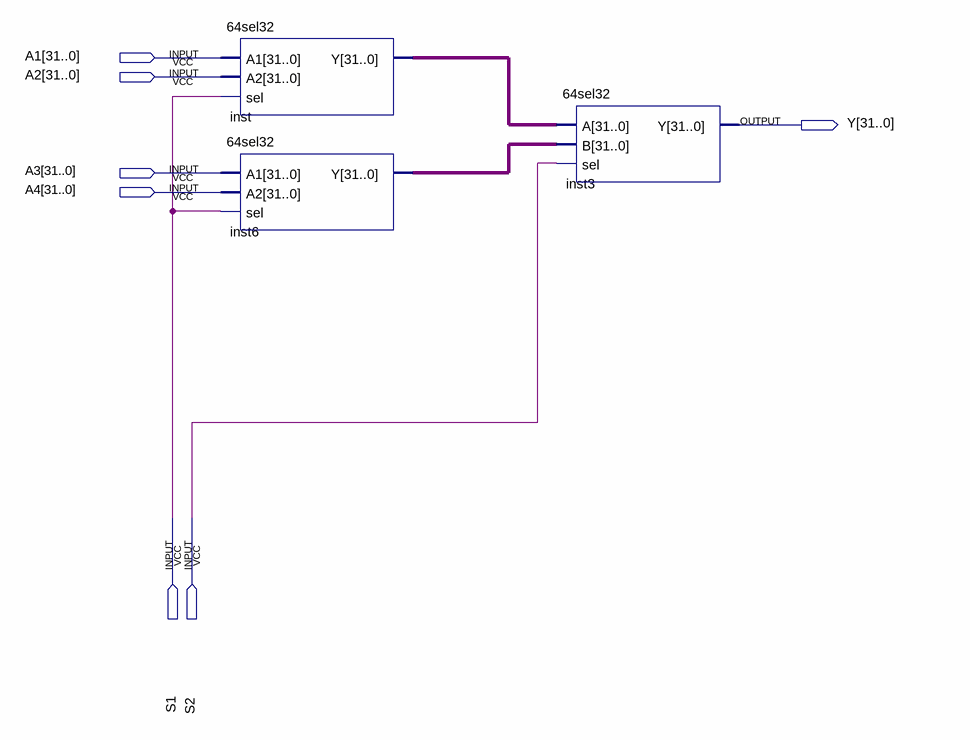
[diagram p0: schematic sheet]
// Quartus schematic 128sel32.bdf as structural Verilog: 3 symbols, 7 pins
module \128sel32  (
  input  [31:0] A1,
  input  [31:0] A2,
  input  [31:0] A3,
  input  [31:0] A4,
  input  S1,
  input  S2,
  output [31:0] Y
);

  wire [31:0] inst6_y, inst_y;

  \64sel32  inst (.A1(A1), .A2(A2), .sel(S1), .Y(inst_y));
  \64sel32  inst6 (.A1(A3), .A2(A4), .sel(S1), .Y(inst6_y));
  \64sel32  inst3 (.A(inst_y), .B(inst6_y), .sel(S2), .Y(Y));
endmodule
